# Altium schematic sheet KaBand RF Device DC Bias A.SchDoc: DC Power Distribution
size B; Date: 3/13/18; Author: Bernard Hwang; CompanyName: National Center for Atmospheric Research; DrawnBy: Bernard Hwang; Engineer: 3/13/18; Organization: Earth Observing Laboratory; Address1: 3450 Mitchell Lane; Address2: FL1; Address3: 3090 Center Green Dr.; Address4: Boulder, CO. 80301; DocumentNumber: Ka Band DC Power Distribution; Revision: A; SheetNumber: 1; SheetTotal: 1; Department: Remote Sensing Facility; PageSetup: Record=PageOptions|CenterHorizontal=True|CenterVertical=True|PrintScale=0.70|XCorrection=1.00|YCorrection=1.00|PrintKind=1|BorderSize=5000000|LeftOffset=0|BottomOffset=0|Orientation=2|PaperLength=1000|PaperWidth=1000|Scale=100|PaperSource=273|PrintQuality=600|MediaType=1|DitherType=10|PrintScaleMode=1|PaperKind=Letter|PaperIndex=1; ModifiedDate: 3/13/18; ImagePath: 3/13/18; ProjectName: Ka Band DC Power Distribution; Application_BuildNumber: 5
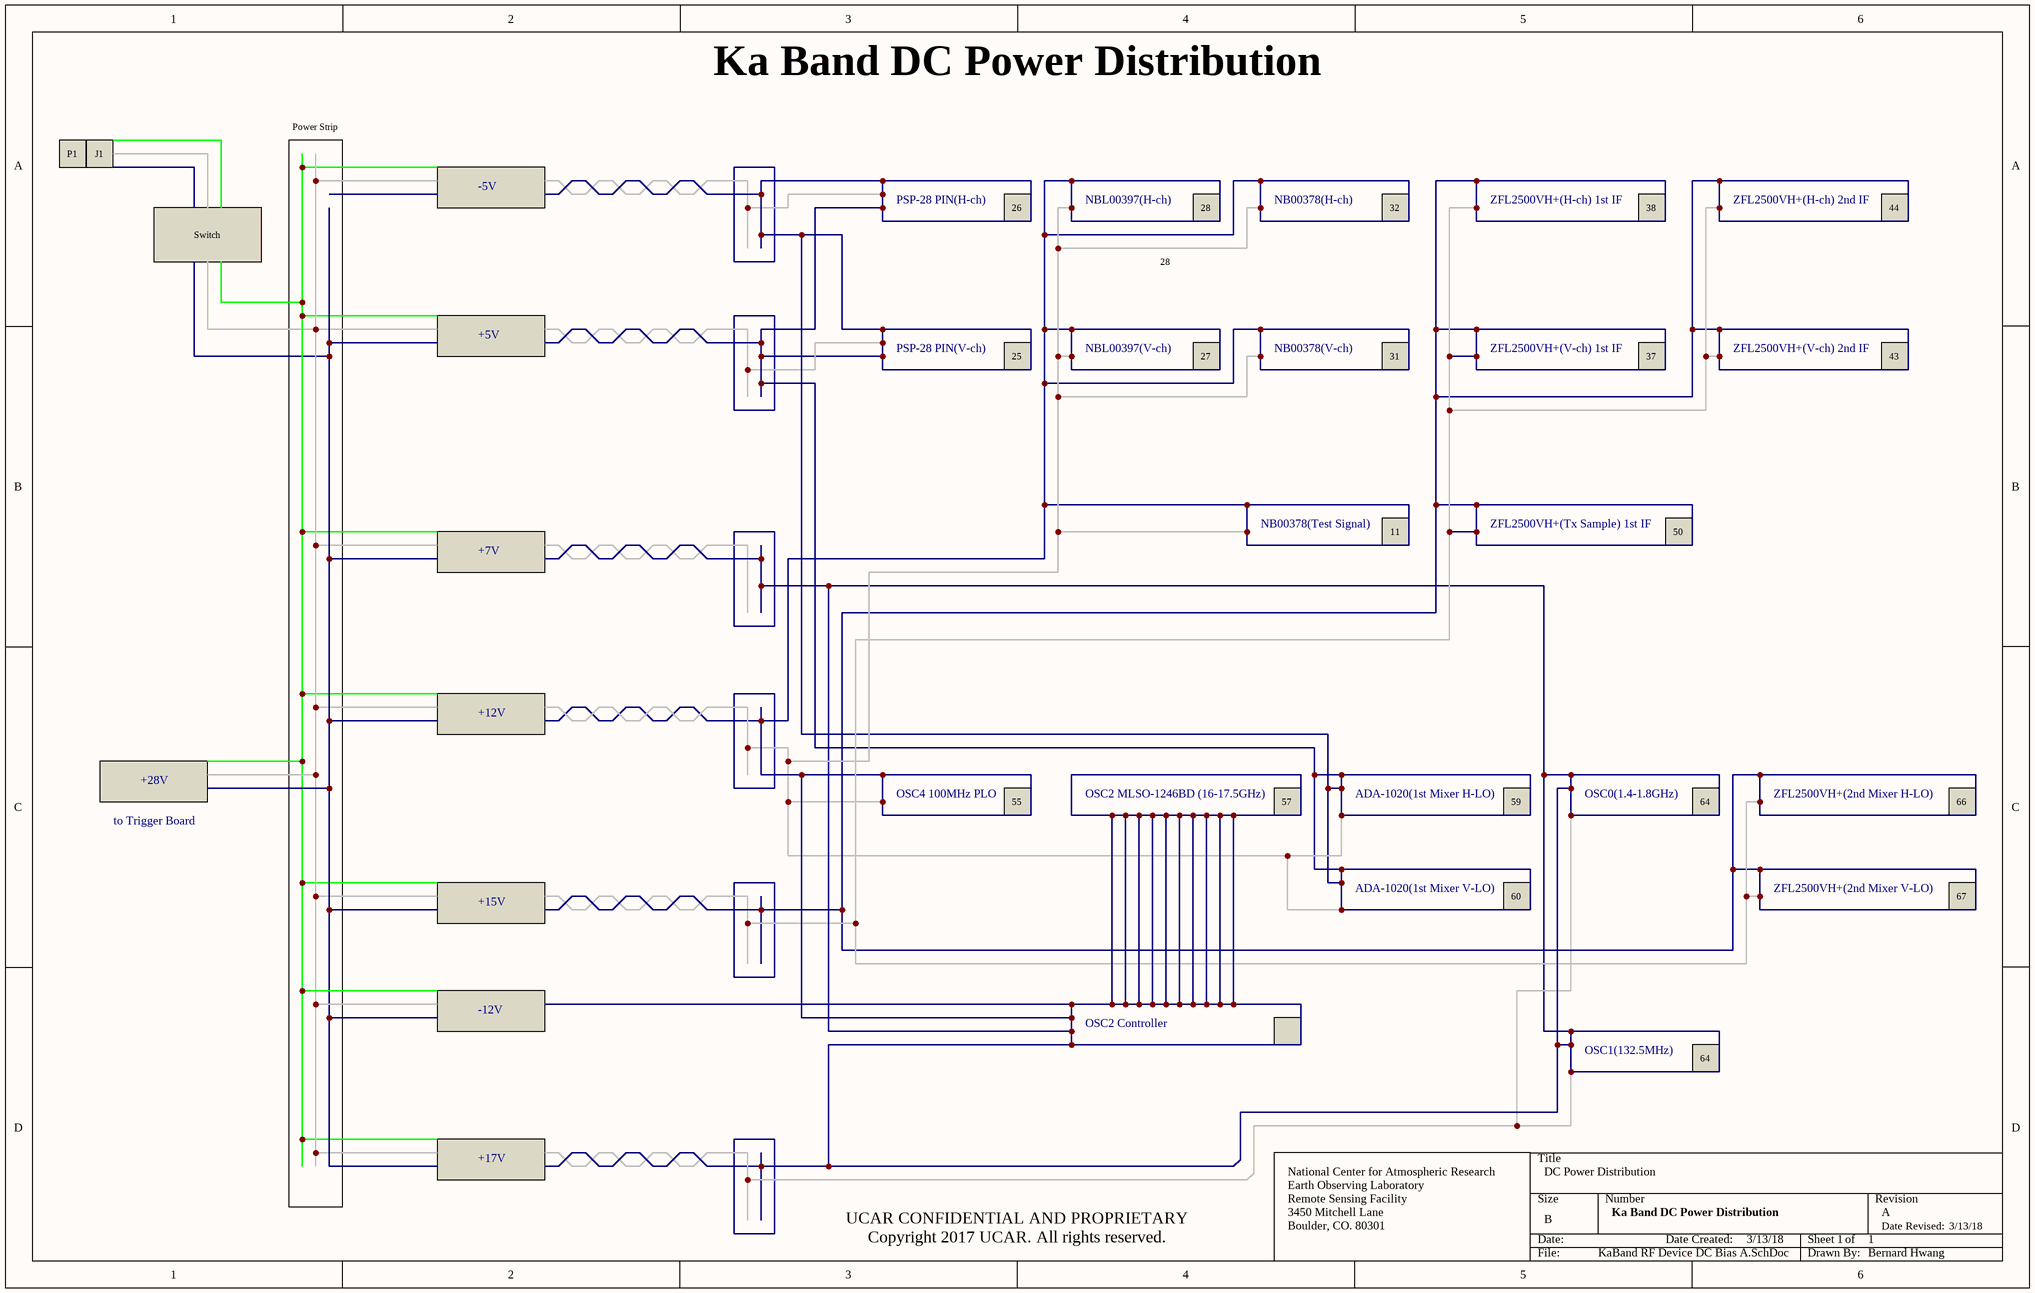
[diagram p0: KaBand RF Device DC Bias A.SchDoc]

## Notes on the sheet
- P1
- J1
- Power Strip
- Switch
- -5V
- PSP-28 PIN(H-ch)
- 26
- NBL00397(H-ch)
- 28
- NB00378(H-ch)
- 32
- ZFL2500VH+(H-ch) 1st IF
- 38
- ZFL2500VH+(H-ch) 2nd IF
- 44
- +5V
- PSP-28 PIN(V-ch)
- 25
- NBL00397(V-ch)
- 27
- NB00378(V-ch)
- 31
- ZFL2500VH+(V-ch) 1st IF
- 37
- ZFL2500VH+(V-ch) 2nd IF
- 43
- +7V
- NB00378(Test Signal)
- 11
- ZFL2500VH+(Tx Sample) 1st IF
- 50
- +12V
- to Trigger Board
- +28V
- OSC4 100MHz PLO
- 55
- OSC2 MLSO-1246BD (16-17.5GHz)
- 57
- ADA-1020(1st Mixer H-LO)
- 59
- OSC0(1.4-1.8GHz)
- 64
- ZFL2500VH+(2nd Mixer H-LO)
- 66
- +15V
- ADA-1020(1st Mixer V-LO)
- 60
- ZFL2500VH+(2nd Mixer V-LO)
- 67
- -12V
- OSC2 Controller
- OSC1(132.5MHz)
- +17V
- UCAR CONFIDENTIAL AND PROPRIETARY
  Copyright 2017 UCAR. All rights reserved.
- Date Created:
- Date Revised: